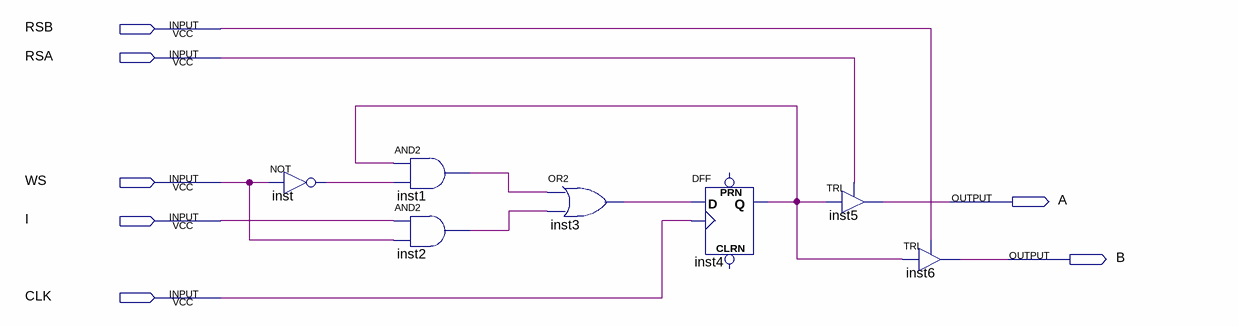
[diagram p0: schematic sheet]
// Quartus schematic REG_CELL_1BIT.bdf as structural Verilog: 7 symbols, 7 pins
module REG_CELL_1BIT (
  input  RSB,
  input  RSA,
  input  WS,
  input  I,
  input  CLK,
  output A,
  output B
);

  wire inst1_out, inst2_out, inst3_out, inst4_q, inst_out;

  not inst (inst_out, WS);
  and inst1 (inst1_out, inst4_q, inst_out);
  and inst2 (inst2_out, I, WS);
  or inst3 (inst3_out, inst1_out, inst2_out);
  DFF inst4 (.CLK(CLK), .D(inst3_out), .Q(inst4_q));  // open: CLRN, PRN
  TRI inst5 (.IN(inst4_q), .OE(RSA), .OUT(A));
  TRI inst6 (.IN(inst4_q), .OE(RSB), .OUT(B));
endmodule
